# Altium project VoodooMagic.PrjPcb (part 2 of 2)

## Sheet 5V5_BOOST.SchDoc: 5V5 BOOST
size 431 x 279 mm; ApprovedBy: Wuji Zhang; CheckedBy: Wuji Zhang; Author: Wuji Zhang; DrawnBy: Wuji Zhang; Organization: Upenn; Address1: ADDRESS 1; Address2: ADDRESS 2; Address3: ADDRESS 3; Address4: ADDRESS 4; Revision: -; SheetNumber: 3; SheetTotal: 8; ENG_APP_DATE: --/--/--; DSN_APP_DATE: --/--/--; CHK_APP_DATE: --/--/--
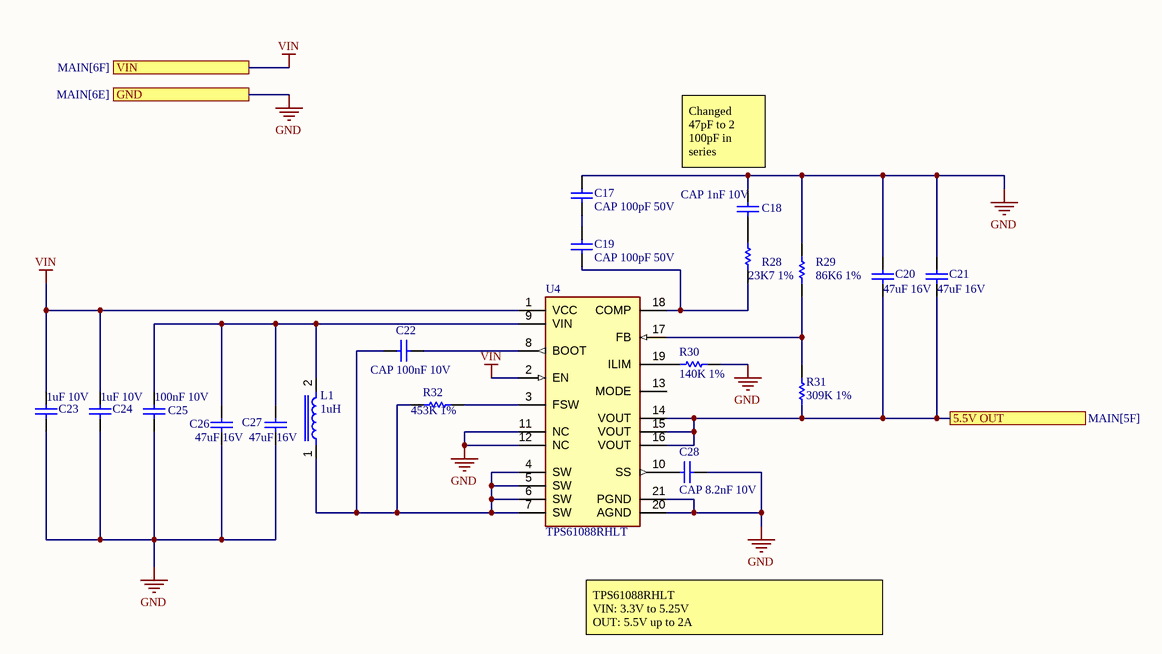
[diagram p5: 5V5_BOOST.SchDoc]

### Parts
(Parts that share a designator on the sheet are numbered #1, #2 ... from top to bottom, then left to right.)
C17  CAP 100pF 50V  [CAPC0603(1608)100_L]
C18  CAP 1nF 10V  [CAPC0603(1608)100_M]
C19  CAP 100pF 50V  [CAPC0603(1608)100_L]
C20  47uF 16V  [MURA-1210_H_2.7_L]
C21  47uF 16V  [MURA-1210_H_2.7_L]
C22  CAP 100nF 10V  [CAPC0603(1608)100_L]
C23  1uF 10V  [CAPC0603(1608)100_M]
C24  1uF 10V  [CAPC0603(1608)100_M]
C25  100nF 10V  [CAPC0603(1608)100_L]
C26  47uF 16V  [MURA-1210_H_2.7_L]
C27  47uF 16V  [MURA-1210_H_2.7_L]
C28  CAP 8.2nF 10V  [CAPC0603(1608)100_N]
L1  1uH  [SRP6540-1R0M]
R28#2  23K7 1%  [RESC0402(1005)_L]
R29  86K6 1%  [RESC0402(1005)_L]
R30  140K 1%  [RESC0402(1005)_M]
R31  309K 1%  [RESC0402(1005)_N]
R32  453K 1%  [RESC0402(1005)_L]
U4  TPS61088RHLT  [FP-RHL0020A-MFG]

### Ports
5.5V OUT (see MAIN[5F]), GND (see MAIN[6E]), VIN (see MAIN[6F])

### Nets
GND: C17.2 C18.2 C20.1 C21.2 C23.1 C24.1 C25.1 C26.2 C27.1 C28.1 R29.1 R30.2 U4.11(NC) U4.12(NC) U4.20(AGND) U4.21(PGND) ; port GND
VIN: C23.2 C24.2 U4.1(VCC) U4.2(EN) ; port VIN  [project net VOUT]
5.5V OUT: C20.2 C21.1 R31.1 U4.14(VOUT) U4.15(VOUT) U4.16(VOUT) ; port 5.5V OUT
NetC17_1: C17.1 C19.2
NetC18_1: C18.1 R28#2.2
NetC19_1: C19.1 R28#2.1 U4.18(COMP)
NetC22_1: C22.1 U4.8(BOOT)
NetC22_2: C22.2 L1.1 R32.1 U4.4(SW) U4.5(SW) U4.6(SW) U4.7(SW)
NetC25_2: C25.2 C26.1 C27.2 L1.2 U4.9(VIN)
NetC28_2: C28.2 U4.10(SS)
NetR29_2: R29.2 R31.2 U4.17(FB)
NetR30_1: R30.1 U4.19(ILIM)
NetR32_2: R32.2 U4.3(FSW)

Not connected (* = marked no-connect by the designer): U4 13(MODE)

### Notes on the sheet
- (near C18) Changed 47pF to 2 100pF in series
- TPS61088RHLT
  VIN: 3.3V to 5.25V
  OUT: 5.5V up to 2A
- DWG. NO.
- REV.
- SHT.
- THIS DOCUMENT AND THE DATA DISCLOSED HEREIN OR HEREWITH IS THE PROPERTY OF ALTIUM LIMITED AND MAY BE FREELY DISTRIBUTED IN WHOLE. NO RIGHTS ARE RESERVED OR EXPRESS OR IMPLIED WARANTEE GIVEN.
- REVISION
- DESCRIPTION
- DATE
- APPROVED
- ENG:
- APPROVALS
- PROJECT
- DSN:
- CHK:
- REFERENCE DOCUMENTS
- PROJECT REVISION:
- TITLE
- DOCUMENT REVISION:
- DESIGN ITEM:
- BOM:
- FAB DWG:
- PCB DWG:
- ASSY DWG:
- SCALE:
- SIZE
- B
- CAGE CODE
- FILE NAME
- DWG NO.
- SHEET
- OF
- REV

### Library data of the parts
C17 C19 = CMP-1035-01271-1: CAP 100pF 50V ±20% 0603 (1608 Metric) Thickness 1mm SMD; Case-Metric: 1608; Tolerance: Â±20%; Case-EIA: 0603; Max Thickness: 1 mm; Technology: SMT; Value: 100pF; Rated Voltage: 50 V
C18 = CMP-1035-01871-1: CAP 1nF 10V ±1% 0603 (1608 Metric) Thickness 1mm SMD; Tolerance: Â±1%; Case-Metric: 1608; Case-EIA: 0603; Technology: SMT; Rated Voltage: 10 V; Value: 1nF; Max Thickness: 1 mm
C20 C21 C26 C27 = CMP-2000-06362-1: Cap Ceramic, 47 uF, +/- 10%, -55 to 85 degC, 2-Pin SMD (1210), RoHS, Tape and Reel; Manufacturer: Murata; Catalog Drawings: GRMSeries_1210_2.5; Capacitance: 47µF; Product Training Modules: High-CapMultilayerCeramicCapacitors; Temperature Coefficient: X5R; Online Catalog: GRMSeries; Other Names: 490-6539-6; Lead Style: -; Voltage Rating DC: 16V; Datasheet URL: http://psearch.en.murata.com/capacitor/product/GRM32ER61C476KE15%23.pdf; Package Description: 2-Pin Surface Mount Device, Body 3.2 x 2.5 mm; Applications: GeneralPurpose; Thickness (Max): 0.106"(2.70mm); Operating Temperature: -55°C~85°C; Mounting Technology: SurfaceMount; Category: Capacitors; Package / Case: 1210(3225Metric); Mounting Type: SurfaceMount,MLCC; Ratings: -; Package Reference: 1210; Height - Seated (Max): -; Series: GRM; Lead Spacing: -; Family: CeramicCapacitors; Datasheet Version: 04/2016; Tolerance: ±10%; Size / Dimension: 0.126"Lx0.098"W(3.20mmx2.50mm); Packaging: Digi-Reel®; Voltage - Rated: 16V; Standard Package: 1; Features: -; Manufacturer URL: http://www.murata.com/
C22 C25 = CMP-1035-02579-1: CAP 100nF 10V ±5% 0603 (1608 Metric) Thickness 1mm SMD; Tolerance: Â±5%; Case-EIA: 0603; Case-Metric: 1608; Value: 100nF; Max Thickness: 1 mm; Rated Voltage: 10 V; Technology: SMT
C23 C24 = CMP-1035-02733-1: CAP 1uF 10V ±10% 0603 (1608 Metric) Thickness 1mm SMD; Tolerance: Â±10%; Case-EIA: 0603; Case-Metric: 1608; Rated Voltage: 10 V; Max Thickness: 1 mm; Value: 1uF; Technology: SMT
C28 = CMP-1035-02280-1: CAP 8.2nF 10V ±5% 0603 (1608 Metric) Thickness 1mm SMD; Tolerance: Â±5%; Case-Metric: 1608; Case-EIA: 0603; Max Thickness: 1 mm; Technology: SMT; Rated Voltage: 10 V; Value: 8.2nF
L1 = SRP6540-1R0M: BOURNS - SRP6540-1R0M - Cewka mocy (SMD), 1 µH, 12 A, Osloniete, 13.5 A, Seria SRP6540, 7.2mm x 6.5mm x 4mm; Core Material: Ferrite; Tolerance: 20%; Shielding: Shielded; Current Rating: 12A; Saturation Current: 13.5A; DC Resistance (DCR): 7.2mR; Test Frequency: 100kHz; MF: Bourns; Purchase-URL: https://pricing.snapeda.com/search/part/SRP6540-1R0M/?ref=eda; SnapEDA_Link: https://www.snapeda.com/parts/SRP6540-1R0M/Bourns/view-part/1499791/?ref=snap; MP: SRP6540-1R0M; Price: None; Package: Nonstandard Bourns; Check_prices: https://www.snapeda.com/parts/SRP6540-1R0M/Bourns/view-part/1499791/?ref=eda; Value: *; Availability: Good; Supplier 1: Digi-Key; Supplier Part Number 1: SRP6540-1R0MCT-ND; Manufacturer: Bourns; Manufacturer Part Number: SRP6540-1R0M; RoHS: Yes; Category: Fixed Inductors; Stock 1: 72210; Pricing 1: 1=1.36000, 10=1.26300, 25=1.16560, 50=0.97120, 100=0.91300, 250=0.81584, 500=0.69930 (USD); Mount: Surface Mount; Case/Package: 2826; Number of Pins: 2; Material: Ferrite; Min Operating Temperature: -55°C; Max Operating Temperature: 125°C; Inductance: 1uH; Packaging: Tape and Reel; Package Quantity: 1200; Inductance Tolerance: 20%; Resistor Type: Wirewound; Max DC Current: 12A; Termination: SMD/SMT; RMS Current (Irms): 12A; Self Resonant Frequency: 100kHz; Series: SRP6540; Sample Rate (Hz): 100kHz; Length: 7.2mm; Width: 6.5mm; Height: 4mm; Height - Seated (Max): 0.157inch; Depth: 6.7mm; REACH SVHC: No SVHC; Military Standard: Not; RoHS Compliant: Yes; ComponentLink1URL: https://datasheet.ciiva.com/28679/1698468-28679543.pdf?src-supplier=Element14; ComponentLink1Description: https://datasheet.ciiva.com/28679/1698468-28679543.pdf?src-supplier=Element14; ComponentLink2URL: https://datasheet.ciiva.com/22667/1698468-22667145.pdf?src-supplier=Element14; ComponentLink2Description: https://datasheet.ciiva.com/22667/1698468-22667145.pdf?src-supplier=Element14; ComponentLink3URL: https://datasheet.ciiva.com/17052/70281705-17052171.pdf?src-supplier=Allied+Electronics; ComponentLink3Description: https://datasheet.ciiva.com/17052/70281705-17052171.pdf?src-supplier=Allied+Electronics
R28#2 = CMP-1011-00663-1: 23K7 0.063W 1% 0402 (1005 Metric)  SMD; Case-Metric: 1005; Case-EIA: 0402; Value: 23700.00 Ohm; Tolerance: 1 %; Technology: SMT; Power: 0.063 W
R29 = CMP-1011-00729-1: 86K6 0.063W 1% 0402 (1005 Metric)  SMD; Case-EIA: 0402; Value: 86600.00 Ohm; Case-Metric: 1005; Technology: SMT; Tolerance: 1 %; Power: 0.063 W
R30 = CMP-1011-00751-1: 140K 0.063W 1% 0402 (1005 Metric)  SMD; Case-EIA: 0402; Case-Metric: 1005; Value: 140000.00 Ohm; Tolerance: 1 %; Technology: SMT; Power: 0.063 W
R31 = CMP-1011-00790-1: 309K 0.063W 1% 0402 (1005 Metric)  SMD; Value: 309000.00 Ohm; Case-EIA: 0402; Case-Metric: 1005; Tolerance: 1 %; Technology: SMT; Power: 0.063 W
R32 = CMP-1011-00810-1: 453K 0.063W 1% 0402 (1005 Metric)  SMD; Value: 453000.00 Ohm; Case-Metric: 1005; Case-EIA: 0402; Tolerance: 1 %; Power: 0.063 W; Technology: SMT
U4 = CMP-04918-000117-1: IC REG BOOST ADJ 10A 20VQFN; Manufacturer: Texas Instruments; Output Voltage: 4.5-12.6V; Max Junction Temp: +125°C; Max Duty Cycle: 90%; Output Type: AdjustableProgrammable; Nominal Supply Current: 1-110uA; Min Supply Voltage: 2.7V; Switching Frequency: 200-2200kHz; Number Of Outputs: 1; Max Supply Voltage: 12V; Manufacturer Part Number: TPS61088RHLT; Digikey Description: IC REG BOOST ADJ 10A 20VQFN; Octopart: https://octopart.com/tps61088rhlt-texas+instruments-57155059; Switching Topology: Boost; Lead Free: Yes; Output Current: 10A; Height: 1mm; Temperature: -40°C to +85°C; Package: RHL0020A; Device Class L3: Voltage Regulators - Switching; RoHS: TRUE; Temperature Range Low: -40°C; Temperature Range High: +85°C; Device Class L1: Integrated Circuits (ICs); Automotive: No; Category: IC; ComponentLink2Description: Datasheet; ComponentLink2URL: http://www.ti.com/lit/ds/symlink/tps61088.pdf; Device Class L2: Power Management ICs

## Sheet 5V5to3V3Buck.SchDoc: 3V3 BUCK
size 431 x 279 mm; ApprovedBy: Wuji Zhang; CheckedBy: Wuji Zhang; Author: Wuji Zhang; CompanyName: Upenn; DrawnBy: Wuji Zhang; Engineer: Wuji Zhang; Organization: Upenn; Address1: ADDRESS 1; Address2: ADDRESS 2; Address3: ADDRESS 3; Address4: ADDRESS 4; Revision: -; SheetNumber: 1; SheetTotal: 8; ENG_APP_DATE: --/--/--; DSN_APP_DATE: --/--/--; CHK_APP_DATE: --/--/--
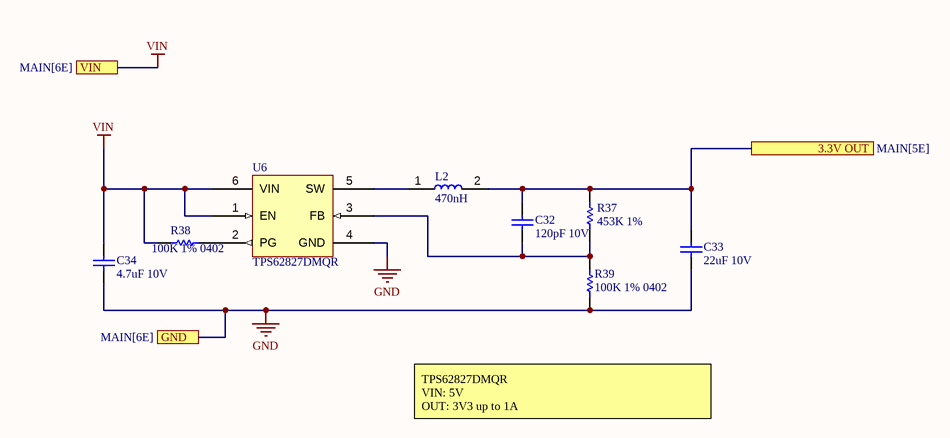
[diagram p6: 5V5to3V3Buck.SchDoc]

### Parts
C32  120pF 10V  [CAPC0603(1608)100_N]
C33  22uF 10V  [CAPC1608X100X20ML10]
C34  4.7uF 10V  [CAPC0603(1608)55_N]
L2  470nH  [MLP2012SR47MT0S1]
R37  453K 1%  [RESC0402(1005)_L]
R38  100K 1% 0402  [RESC0402(1005)_M]
R39  100K 1% 0402  [RESC0402(1005)_M]
U6  TPS62827DMQR  [Texas_Instruments_DMQ0006A_MFG]

### Ports
3.3V OUT (see MAIN[5E]), GND (see MAIN[6E]), VIN (see MAIN[6E])

### Nets
GND: C33.1 C34.1 R39.1 U6.4(GND) ; port GND
VIN: C34.2 R38.1 U6.1(EN) U6.6(VIN) ; port VIN  [project net 5V5]
3.3V OUT: C32.2 C33.2 L2.2 R37.1 ; port 3.3V OUT
NetC32_1: C32.1 R37.2 R39.2 U6.3(FB)
NetL2_1: L2.1 U6.5(SW)
NetR38_2: R38.2 U6.2(PG)

### Notes on the sheet
- TPS62827DMQR
  VIN: 5V
  OUT: 3V3 up to 1A
- DWG. NO.
- REV.
- SHT.
- THIS DOCUMENT AND THE DATA DISCLOSED HEREIN OR HEREWITH IS THE PROPERTY OF ALTIUM LIMITED AND MAY BE FREELY DISTRIBUTED IN WHOLE. NO RIGHTS ARE RESERVED OR EXPRESS OR IMPLIED WARANTEE GIVEN.
- REVISION
- DESCRIPTION
- DATE
- APPROVED
- ENG:
- APPROVALS
- PROJECT
- DSN:
- CHK:
- REFERENCE DOCUMENTS
- PROJECT REVISION:
- TITLE
- DOCUMENT REVISION:
- DESIGN ITEM:
- BOM:
- FAB DWG:
- PCB DWG:
- ASSY DWG:
- SCALE:
- SIZE
- B
- CAGE CODE
- FILE NAME
- DWG NO.
- SHEET
- OF
- REV

### Library data of the parts
C32 = CMP-1035-01305-1: CAP 120pF 10V ±10% 0603 (1608 Metric) Thickness 1mm SMD; Case-EIA: 0603; Case-Metric: 1608; Tolerance: Â±10%; Technology: SMT; Rated Voltage: 10 V; Value: 120pF; Max Thickness: 1 mm
C33 = CMP-2000-05441-1: Chip Capacitor, 22 uF, +/- 20%, 10 V, -55 to 85 degC, 0603 (1608 Metric), RoHS, Tape and Reel; Manufacturer: TDK; PCN Part Number: MLCCPartNumberChange30/Nov/2012; Product Training Modules: CSeriesGeneralApplicationsSEAT,CCV,andTVCLDesignToolsGuidetoReplacinganElectrolyticCapacitorwithanMLCC; Other Names: 445-9077-1; Design Resources: 20WNon-IsolatedBuckLEDDriverUsingPLLNK460KG; Online Catalog: CSeries,GeneralPurpose; Capacitance: 22µF; Temperature Coefficient: X5R; Kits: 445-9014-KIT-ND-KITMLCC100PF-22UF060310-50V; Packaging: CutTape(CT); Standard Package: 1; Package / Case: 0603(1608Metric); Lead Style: -; Features: -; Ratings: -; Voltage - Rated: 10V; Operating Temperature: -55degC~85degC; Applications: GeneralPurpose; Package Reference: 603; Datasheet URL: http://download.siliconexpert.com/pdfs/2015/4/21/15/54/45/779/tdk_/manual/37024850441143360mlcc_commercial_general_en.pdf; Datasheet Version: Mar-15; Mounting Type: SurfaceMount,MLCC; Lead Spacing: -; Size / Dimension: 0.063"Lx0.031"W(1.60mmx0.80mm); Height - Seated (Max): -; Package Description: 2-Pin Surface Mount Device, Body 1.6 x 0.8 mm; Manufacturer URL: http://www.tdk.com/; RoHS Information: RoHSCertificate-MLCC; Tolerance: ±20%; Series: C; Thickness (Max): 0.035"(0.90mm); Family: CeramicCapacitors; Category: Capacitors
C34 = CMP-1035-02784-1: CAP 4.7uF 10V ±10% 0603 (1608 Metric) Thickness 0.55mm SMD; Case-Metric: 1608; Tolerance: Â±10%; Case-EIA: 0603; Technology: SMT; Max Thickness: 0.55 mm; Value: 4.7uF; Rated Voltage: 10 V
L2 = MLP2012SR47MT0S1: FIXED IND 470NH 1.2A 90 MOHM SMD; Manufacturer: TDK; Core Material: Ferrite; Tolerance: 20%; DC Resistance (DCR): 117mR; Shielding: Shielded; Test Frequency: 2MHz; Package: None; Price: None; Value: *; MP: MLP2012SR47MT0S1; Availability: Unavailable; Supplier 1: Digi-Key; Supplier Part Number 1: 445-6367-1-ND; Manufacturer Part Number: MLP2012SR47MT0S1; RoHS: Yes; Category: Fixed Inductors; Stock 1: 14052; Pricing 1: 1=0.33000, 10=0.29100, 25=0.25480, 50=0.21840, 100=0.20020, 250=0.18200, 500=0.17108, 1000=0.13104 (USD); Mount: Surface Mount; Case/Package: 0805; Case Code (Metric): 2012; Case Code (Imperial): 0805; Min Operating Temperature: -40°C; Max Operating Temperature: 125°C; Packaging: Tape and Reel; Inductance: 470nH; Package Quantity: 4000; Current Rating: 1.2A; Length: 0.079inch; Width: 0.049inch; Height - Seated (Max): 0.022inch; RoHS Compliant: Yes; ComponentLink1URL: https://product.tdk.com/info/en/catalog/datasheets/inductor_commercial_power_mlp2012_en.pdf?src-supplier=Digi-Key; ComponentLink1Description: https://product.tdk.com/info/en/catalog/datasheets/inductor_commercial_power_mlp2012_en.pdf?src-supplier=Digi-Key
R37 = CMP-1011-00810-1: as R32 on sheet 5V5_BOOST; Tolerance: 1 %; Power: 0.063 W; Technology: SMT
R38 R39 = CMP-1011-00736-1: 100K 0.063W 1% 0402 (1005 Metric)  SMD; Value: 100000.00 Ohm; Case-EIA: 0402; Case-Metric: 1005; Power: 0.063 W; Tolerance: 1 %; Technology: SMT
U6 = TPS62827DMQR: 2.4V-5.5V input, 4A step-down converter with 1% Accuracy in 1.5mm x 1.5mm QFN 6-VSON-HR -40 to 125; Manufacturer: Texas Instruments; Supplier 1: Digi-Key; Manufacturer Part Number: TPS62827DMQR; RoHS: Yes; Category: Voltage Regulators - Switching; Pricing 1: 1=1.93000, 10=1.73000, 25=1.63240, 100=1.30590, 250=1.14268, 500=1.11004, 1000=0.88150 (USD); RoHS Compliant: Yes; Supplier Part Number 1: 296-TPS62827DMQRCT-ND

## Sheet Sensors.SchDoc: Sensors
size 431 x 279 mm; ApprovedBy: Wuji Zhang; CheckedBy: Wuji Zhang; Author: Wuji Zhang; CompanyName: Upenn; DrawnBy: Wuji Zhang; Engineer: Wuji Zhang; Organization: Upenn; Address1: ADDRESS 1; Address2: ADDRESS 2; Address3: ADDRESS 3; Address4: ADDRESS 4; Revision: -; SheetNumber: 9; SheetTotal: 9; ENG_APP_DATE: --/--/--; DSN_APP_DATE: --/--/--; CHK_APP_DATE: --/--/--
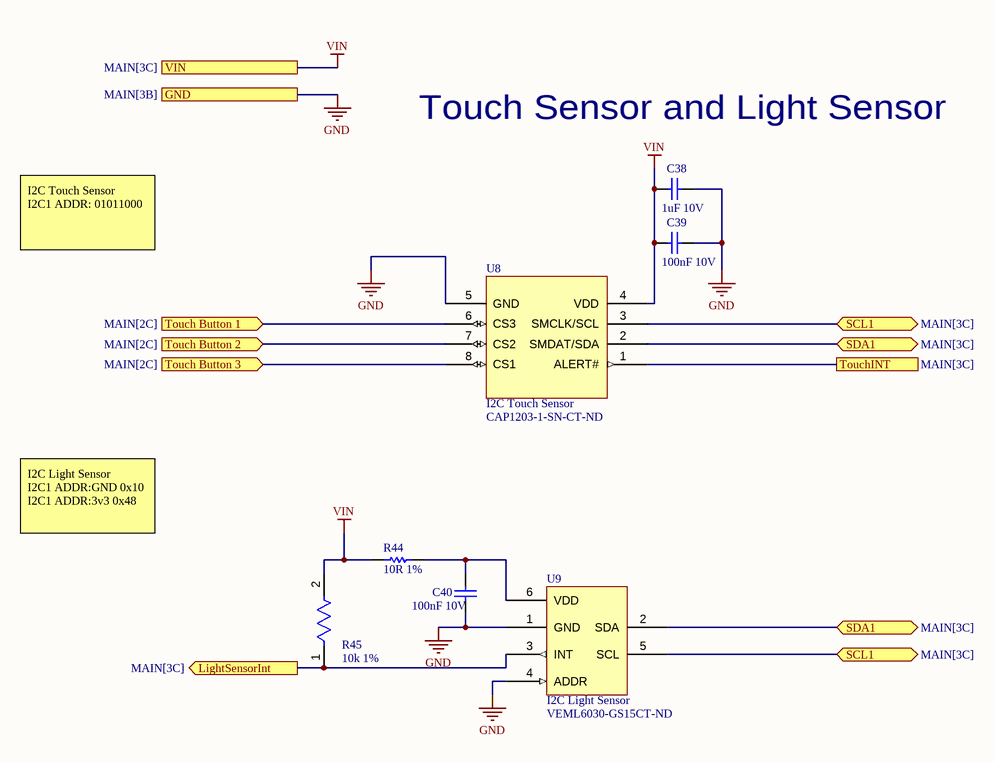
[diagram p7: Sensors.SchDoc]

### Parts
C38  1uF 10V  [CAPC0402(1005)60_N]
C39  100nF 10V  [CAPC0402(1005)60_L]
C40  100nF 10V  [CAPC0402(1005)60_L]
R44  10R 1%  [RESC0402(1005)_N]
R45  10k 1%  [FP-CRCW0402-e3-IPC_C]
U8  I2C Touch Sensor  Supplier Part Number 1: CAP1203-1-SN-CT-ND  [CAP1203-1-SN-TR]
U9  I2C Light Sensor  Supplier Part Number 1: VEML6030-GS15CT-ND  [CAC-65P200X200-6N]

### Ports
GND (see MAIN[3B]), LightSensorInt (out, see MAIN[3C]), SCL1 (bidir, see MAIN[3C]), SDA1 (bidir, see MAIN[3C]), Touch Button 1 (in, see MAIN[2C]), Touch Button 2 (in, see MAIN[2C]), Touch Button 3 (in, see MAIN[2C]), TouchINT (see MAIN[3C]), VIN (see MAIN[3C])

### Nets
GND: C38.2 C39.2 C40.1 U8.5(GND) U9.1(GND) U9.4(ADDR) ; port GND
VIN: C38.1 C39.1 R44.1 R45.2 U8.4(VDD) ; port VIN  [project net 3V3]
Light INT: R45.1 U9.3(INT) ; port LightSensorInt
SERCOM3 I2C1 SCL: U8.3(SMCLK/SCL) U9.5(SCL) ; port SCL1
SERCOM3 I2C1 SDA: U8.2(SMDAT/SDA) U9.2(SDA) ; port SDA1
Touch Button 1: U8.6(CS3) ; port Touch Button 1
Touch Button 2: U8.7(CS2) ; port Touch Button 2
Touch Button 3: U8.8(CS1) ; port Touch Button 3
Touch INT: U8.1(ALERT#) ; port TouchINT
NetC40_2: C40.2 R44.2 U9.6(VDD)

### Notes on the sheet
- Touch Sensor and Light Sensor
- I2C Touch Sensor     I2C1 ADDR: 01011000
- I2C Light Sensor     I2C1 ADDR:GND 0x10 I2C1 ADDR:3v3 0x48
- DWG. NO.
- REV.
- SHT.
- THIS DOCUMENT AND THE DATA DISCLOSED HEREIN OR HEREWITH IS THE PROPERTY OF ALTIUM LIMITED AND MAY BE FREELY DISTRIBUTED IN WHOLE. NO RIGHTS ARE RESERVED OR EXPRESS OR IMPLIED WARANTEE GIVEN.
- REVISION
- DESCRIPTION
- DATE
- APPROVED
- ENG:
- APPROVALS
- PROJECT
- DSN:
- CHK:
- REFERENCE DOCUMENTS
- PROJECT REVISION:
- TITLE
- DOCUMENT REVISION:
- DESIGN ITEM:
- BOM:
- FAB DWG:
- PCB DWG:
- ASSY DWG:
- SCALE:
- SIZE
- B
- CAGE CODE
- FILE NAME
- DWG NO.
- SHEET
- OF
- REV

### Library data of the parts
C38 = CMP-1034-02116-1: CAP 1uF 10V ±10% 0402 (1005 Metric) Thickness 0.6mm SMD; Tolerance: Â±10%; Case-Metric: 1005; Case-EIA: 0402; Value: 1uF; Technology: SMT; Max Thickness: 0.6 mm; Rated Voltage: 10 V
C39 C40 = CMP-1034-02064-1: CAP 100nF 10V ±5% 0402 (1005 Metric) Thickness 0.6mm SMD; Tolerance: Â±5%; Case-EIA: 0402; Case-Metric: 1005; Max Thickness: 0.6 mm; Value: 100nF; Rated Voltage: 10 V; Technology: SMT
R44 = CMP-1011-00284-1: 10R 0.063W 1% 0402 (1005 Metric)  SMD; Case-EIA: 0402; Case-Metric: 1005; Value: 10.00 Ohm; Power: 0.063 W; Technology: SMT; Tolerance: 1 %
R45 = CMP-1011-00623-2: RES Thick Film, 10kΩ, 1%, 0.063W, 100ppm/°C, 0402; Max Power Dissipation: 63mW; Resistance: 10kR; Tolerance: 1%; Case/Package: 0402; Case Code (Imperial): 0402; Case Code (Metric): 1005; Composition: Thick Film; Contact Plating: Tin; Depth: 0.5mm; Features: Automotive AEC-Q200; Height: 0.016inch; Lead Free: Lead Free; Length: 0.039inch; Max Operating Temperature: 155°C; Military Standard: Not; Min Operating Temperature: -55°C; Number of Terminations: 2; Packaging: Tape and Reel; Radiation Hardening: No; Temperature Coefficient: 100ppm/°C; Width: 0.02inch
U8 = CAP1203-1-SN-TR: Sensor Controller Capacitive 3-CH I2C 8-Pin SOIC T/R; Manufacturer: Microchip; Supplier 1: Digi-Key; Manufacturer Part Number: CAP1203-1-SN-TR; RoHS: No; Category: Integrated Circuits (ICs); Stock 1: 7847; Pricing 1: 1=0.55000, 25=0.50000, 100=0.45000 (USD); ComponentLink1URL: http://www.microchip.com/mymicrochip/filehandler.aspx?ddocname=en566286&src-supplier=Digi-Key; ComponentLink1Description: http://www.microchip.com/mymicrochip/filehandler.aspx?ddocname=en566286&src-supplier=Digi-Key
U9 = VEML6030-GS15: HIGH ACCURACY AMBIENT LIGHT SENS; Manufacturer: Vishay Semiconductors; Wavelength: 550nm; Supplier 1: Digi-Key; Manufacturer Part Number: VEML6030-GS15; RoHS: Yes; Category: Sensors; Stock 1: 1378; Pricing 1: 1=2.00000, 5=1.89000, 10=1.62000, 25=1.29600, 50=1.18800, 100=1.08000, 500=0.94500, 1000=0.83700, 5000=0.78300 (USD); Mount: Surface Mount; Case/Package: SMD/SMT; Min Operating Temperature: -25°C; Max Operating Temperature: 85°C; Output Type: I2C; Packaging: Tape and Reel; RoHS Compliant: Yes; ComponentLink1URL: http://www.vishay.com/docs/84366/veml6030.pdf?src-supplier=Digi-Key; ComponentLink1Description: http://www.vishay.com/docs/84366/veml6030.pdf?src-supplier=Digi-Key

## Nets that join several sheets
3V3: MAIN (11 pins), MCU (7 pins), Memory (5 pins), Sensors (5 pins)
5V5: MAIN (R6.2 TP4.1), 5V5to3V3Buck (C34.2 R38.1 U6.1 U6.6)
GND: MAIN (16 pins), FTDI (10 pins), MCU (19 pins), Memory (5 pins), LiPo_Charger (11 pins), 5V5_BOOST (16 pins), 5V5to3V3Buck (C33.1 C34.1 R39.1 U6.4), Sensors (6 pins)
VBAT: MAIN (P1.3), LiPo_Charger (C31.1 U5.2 U5.3)
VBUS: MAIN (J1.1), FTDI (C2.2 D2.4 FB1.1)
VOUT: MAIN (R7.2 TP11.1), 5V5_BOOST (C23.2 C24.2 U4.1 U4.2)
Vout_BQ: MAIN (R7.1), LiPo_Charger (6 pins)
VUSB: MAIN (TP1.1), FTDI (6 pins), LiPo_Charger (C29.2 U5.13)
3.3V OUT: MAIN (R8.1), 5V5to3V3Buck (C32.2 C33.2 L2.2 R37.1)
5.5V OUT: MAIN (R6.1), 5V5_BOOST (6 pins)
BQ_BAT_TS: MAIN (R9.1 TP8.1), LiPo_Charger (U5.1)
Button: MAIN (C10.2 R22.1 R23.1), MCU (U3.47)
FLASH_MEM_SPI_SS: MCU (U3.37), Memory (R27.1 SD1.2 TP23.1)
GPIO LIGHT INT: MAIN (R16.1), MCU (U3.40)
GPIO Touch INT: MAIN (R18.1), MCU (U3.41)
Light INT: MAIN (R16.2), Sensors (R45.1 U9.3)
MCU_LED: MAIN (D3.2), MCU (U3.16)
MCU_RX_UART_CLI: MAIN (TP6.1), FTDI (U1.7), MCU (U3.44)
MCU_TX_UART_CLI: MAIN (TP2.1), FTDI (U1.10), MCU (U3.43)
MEM_SPI_CLK: MAIN (R21.2), Memory (SD1.5 TP22.1)
MEM_SPI_MISO: MAIN (R20.2), Memory (SD1.7 TP21.1)
MEM_SPI_MOSI: MAIN (R19.2), Memory (SD1.3 TP20.1)
SERCOM0 I2C0 SCL: MAIN (P4.2 R12.1 TP10.1), MCU (U3.15)
SERCOM0 I2C0 SDA: MAIN (P4.1 R10.1 TP12.1), MCU (U3.9)
SERCOM1_PAD2_SPI_MISO: MAIN (R20.1), MCU (U3.8)
SERCOM1_PAD2_SPI_MOSI: MAIN (R19.1), MCU (U3.11)
SERCOM1_PAD3_SPI_SCK: MAIN (R21.1), MCU (U3.12)
SERCOM3 I2C1 SCL: MAIN (P2.1 P3.1 R14.2 TP3.1), Sensors (U8.3 U9.5)
SERCOM3 I2C1 SCL: MAIN (R13.1 R14.1), MCU (U3.39)
SERCOM3 I2C1 SDA: MAIN (P2.2 P3.2 R15.2 TP7.1), Sensors (U8.2 U9.2)
SERCOM3 I2C1 SDA: MAIN (R11.1 R15.1), MCU (U3.38)
Touch Button 1: MAIN (P5.1), Sensors (U8.6)
Touch Button 2: MAIN (P5.2), Sensors (U8.7)
Touch Button 3: MAIN (P5.3), Sensors (U8.8)
Touch INT: MAIN (R18.2), Sensors (U8.1)
USB_DATA_N: MAIN (J1.2), FTDI (C5.2 D2.3 R1.1)
USB_DATA_P: MAIN (J1.3), FTDI (C6.2 D2.2 R2.1)

## Assembly variants
Build_Alt: not fitted FD1 FD2 FD3 TP1 TP2 TP5 TP6 TP9